# Altium schematic sheet Top Level.SchDoc
size 431 x 279 mm; Organization: ORGANIZATION; Address1: ADDRESS 1; Address2: ADDRESS 2; Address3: ADDRESS 3; Address4: ADDRESS 4; Revision: -; SheetNumber: 1; SheetTotal: 5; ENG_APP_DATE: --/--/--; DSN_APP_DATE: --/--/--; CHK_APP_DATE: --/--/--
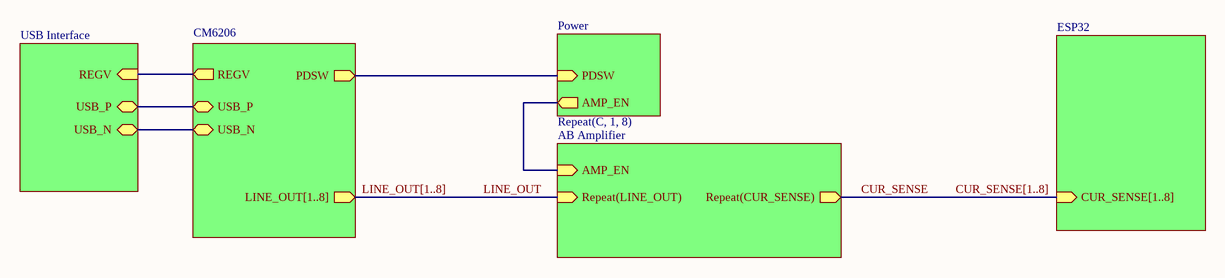
[diagram p0: Top Level.SchDoc]

## Sub-sheets
CM6206 = CM6206: PDSW (out), USB_P (bidir), USB_N (bidir), REGV (out), LINE_OUT[1..8] (out)
Designator = ESP32: CUR_SENSE[1..8] (in)
Power = Power: PDSW (in), AMP_EN (out)
Repeat(C, 1, 8) = AB Amplifier: Repeat(LINE_OUT) (in), Repeat(CUR_SENSE) (out), AMP_EN (in)
USB = USB Interface: USB_N (bidir), USB_P (bidir), REGV (in)

## Nets
CUR_SENSE: sheet Repeat(C, 1, 8)/Repeat(CUR_SENSE)
LINE_OUT: sheet Repeat(C, 1, 8)/Repeat(LINE_OUT)
(unnamed): sheet USB/USB_N, sheet CM6206/USB_N
(unnamed): sheet USB/USB_P, sheet CM6206/USB_P
(unnamed): sheet USB/REGV, sheet CM6206/REGV
(unnamed): sheet CM6206/PDSW, sheet Power/PDSW
(unnamed): sheet Power/AMP_EN, sheet Repeat(C, 1, 8)/AMP_EN

## Buses and harness runs
bus CUR_SENSE[1..8] = sheet Designator/CUR_SENSE[1..8]
bus LINE_OUT[1..8] = sheet CM6206/LINE_OUT[1..8]

## Notes on the sheet
- DWG. NO.
- REV.
- SHT.
- THIS DOCUMENT AND THE DATA DISCLOSED HEREIN OR HEREWITH IS THE PROPERTY OF ALTIUM LIMITED AND MAY BE FREELY DISTRIBUTED IN WHOLE. NO RIGHTS ARE RESERVED OR EXPRESS OR IMPLIED WARANTEE GIVEN.
- REVISION
- DESCRIPTION
- DATE
- APPROVED
- ENG:
- APPROVALS
- PROJECT
- DSN:
- CHK:
- REFERENCE DOCUMENTS
- PROJECT REVISION:
- TITLE
- DOCUMENT REVISION:
- DESIGN ITEM:
- BOM:
- FAB DWG:
- PCB DWG:
- ASSY DWG:
- SCALE:
- SIZE
- B
- CAGE CODE
- FILE NAME
- DWG NO.
- SHEET
- OF
- REV